# Altium project WIoT-Shield01.PrjPcb
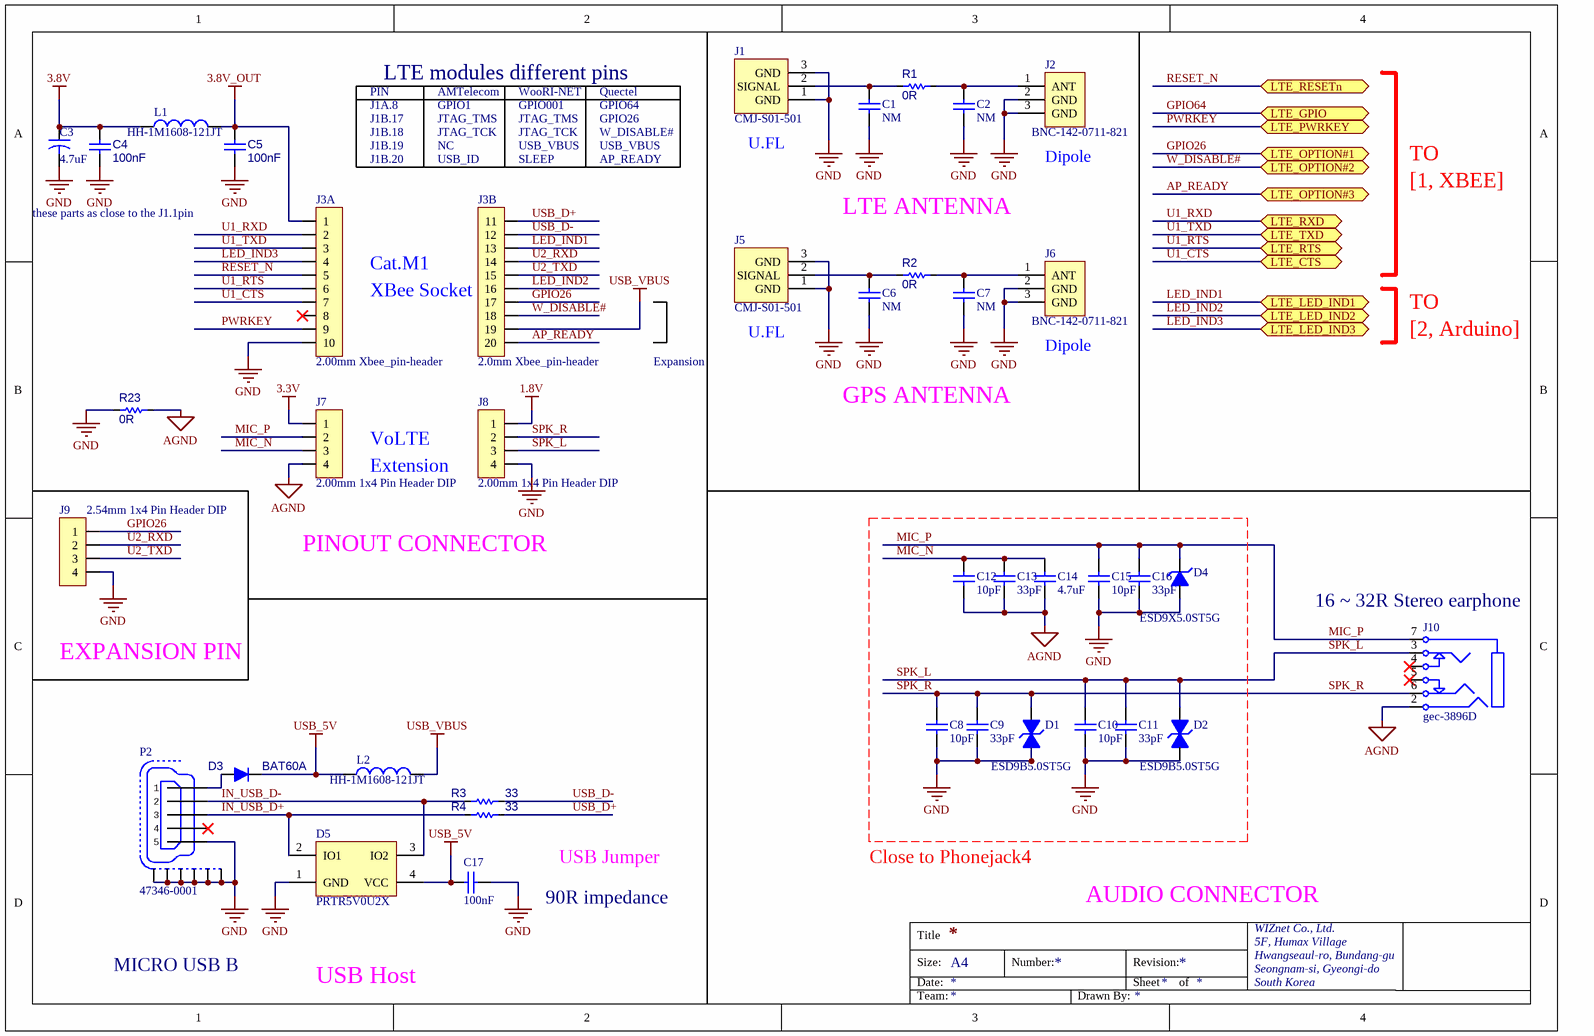
[diagram p0: 1.XBEE Interface.SchDoc]
3 sheets, 119 parts. Net scope: flat (ports and power ports of the same name join across sheets).
Board file: WIoT-Shield01.PcbDoc
Sheets:
  1.XBEE Interface.SchDoc
  2.Arduino Pinout.SchDoc
  3.POWER.SchDoc

## Sheet 1.XBEE Interface.SchDoc
size A4

### Parts
C1  NM  [CAP-0402]
C2  NM  [CAP-0402]
C3  4.7uF  [CAP-A Size]
C4  100nF  [CAP-0603]
C5  100nF  [CAP-0603]
C6  NM  [CAP-0402]
C7  NM  [CAP-0402]
C8  10pF  [CAP-0402]
C9  33pF  [CAP-0402]
C10  10pF  [CAP-0402]
C11  33pF  [CAP-0402]
C12  10pF  [CAP-0402]
C13  33pF  [CAP-0402]
C14  4.7uF  [CAP-0603]
C15  10pF  [CAP-0402]
C16  33pF  [CAP-0402]
C17  100nF  [CAP-0402]
D1  ESD9B5.0ST5G  [SOD-882(TVS)]
D2  ESD9B5.0ST5G  [SOD-882(TVS)]
D3  BAT60A  [SOD-323(1-C,2-A)]
D4  ESD9X5.0ST5G  [SOD-923(1-C,2-A)]
D5  PRTR5V0U2X  [SOT-143]
J1  CMJ-S01-501  [BNC-CMJ-S01-501]
J2  BNC-142-0711-821  [BNC-142-0711-821]
J3  2.00mm Xbee_pin-header  [XBEE(1)]  (parts A,B of 2)
J5  CMJ-S01-501  [BNC-CMJ-S01-501]
J6  BNC-142-0711-821  [BNC-142-0711-821]
J7  2.00mm 1x4 Pin Header DIP  [IDC-1X4(2MM)]
J8  2.00mm 1x4 Pin Header DIP  [IDC-1X4(2MM)]
J9  2.54mm 1x4 Pin Header DIP  [IDC-1X4]
J10  gec-3896D  [PJ-3.5-3106]
L1  HH-1M1608-121JT  [IND-0603]
L2  HH-1M1608-121JT  [IND-0603]
P2  47346-0001  [USB-MOLEX-47346]
R1  0R  [RES-0402]
R2  0R  [RES-0402]
R3  33  [RES-0603]
R4  33  [RES-0603]
R23  0R  [RES-0603]

### Ports
LTE_CTS, LTE_GPIO, LTE_LED_IND1, LTE_LED_IND2, LTE_LED_IND3, LTE_OPTION#1, LTE_OPTION#2, LTE_OPTION#3, LTE_PWRKEY, LTE_RESETn, LTE_RTS, LTE_RXD, LTE_TXD

### Nets
1.8V: J8.1
3.3V: J7.1
3.8V: C3.1 C4.1 L1.1
3.8V_OUT: C5.1 J3.1 L1.2
AGND: C12.1 C13.1 C14.1 J7.4 J10.2 R23.2
GND: C1.1 C2.1 C3.2 C4.2 C5.2 C6.1 C7.1 C8.1 C9.1 C10.1 C11.1 C15.1 C16.1 C17.2 D1.2 D2.2 D4.2 D5.1(GND) J1.1(GND) J1.3(GND) J2.2(GND) J2.3(GND) J3.10 J5.1(GND) J5.3(GND) J6.2(GND) J6.3(GND) J8.4 J9.4 P2.5 P2.6 P2.7 P2.8 P2.9 P2.10 P2.11 R23.1
USB_5V: C17.1 D3.1(K) D5.4(VCC) L2.1  [project net 5V]
USB_VBUS: J3.19 L2.2
AP_READY: J3.20 ; port LTE_OPTION#3
GPIO26: J3.17 J9.1 ; port LTE_OPTION#1
GPIO64: port LTE_GPIO
IN_USB_D+: D5.2(IO1) P2.3 R4.2
IN_USB_D-: D5.3(IO2) P2.2 R3.2
LED_IND1: J3.13 ; port LTE_LED_IND1
LED_IND2: J3.16 ; port LTE_LED_IND2
LED_IND3: J3.4 ; port LTE_LED_IND3
MIC_N: C12.2 C13.2 C14.2 J7.3
MIC_P: C15.2 C16.2 D4.1 J7.2 J10.7
PWRKEY: J3.9 ; port LTE_PWRKEY
RESET_N: J3.5 ; port LTE_RESETn
SPK_L: C10.2 C11.2 D2.1 J8.3 J10.3
SPK_R: C8.2 C9.2 D1.1 J8.2 J10.6
U1_CTS: J3.7 ; port LTE_CTS
U1_RTS: J3.6 ; port LTE_RTS
U1_RXD: J3.2 ; port LTE_RXD
U1_TXD: J3.3 ; port LTE_TXD
U2_RXD: J3.14 J9.2
U2_TXD: J3.15 J9.3
USB_D+: J3.11 R4.1
USB_D-: J3.12 R3.1
W_DISABLE#: J3.18 ; port LTE_OPTION#2
NetC1_2: C1.2 J1.2(SIGNAL) R1.1
NetC2_2: C2.2 J2.1(ANT) R1.2
NetC6_2: C6.2 J5.2(SIGNAL) R2.1
NetC7_2: C7.2 J6.1(ANT) R2.2
NetD3_2: D3.2(A) P2.1

Not connected (* = marked no-connect by the designer): J3 8*; J10 4* 5*; P2 4*

### Notes on the sheet
- J1A.8
- PIN
- LTE modules different pins
- AMTelecom
- GPIO1
- WooRI-NET
- GPIO001
- Quectel
- GPIO64
- J1B.17
- J1B.18
- J1B.19
- J1B.20
- USB_ID
- NC
- JTAG_TMS
- JTAG_TCK
- SLEEP
- USB_VBUS
- GPIO26
- W_DISABLE#
- AP_READY
- (near J1) U.FL
- (near J2) Dipole
- TO
- these parts as close to the J1.1pin
- LTE ANTENNA
- [1, XBEE]
- (near J3) XBee Socket
- Cat.M1
- Expansion
- (near J5) U.FL
- (near J6) Dipole
- [2, Arduino]
- VoLTE
- GPS ANTENNA
- Extension
- PINOUT CONNECTOR
- (near J10) 16 ~ 32R Stereo earphone
- EXPANSION PIN
- 90R impedance
- USB Jumper
- Close to Phonejack4
- AUDIO CONNECTOR
- MICRO USB B
- USB Host
- Title
- Size:
- Date:
- A4
- Number:
- Revision:
- Sheet
- of
- WIZnet Co., Ltd.
- 5F, Humax Village
- Hwangseaul-ro, Bundang-gu
- Seongnam-si, Gyeongi-do
- South Korea
- Team:
- Drawn By:

### Library data of the parts
C1 C2 C6-C13 C15 C16 = CAP-0402: Ceramic CAP 0402(1005)
C3 = CAP: Electrolytic Capacitors
C4 C5 C14 = CAP-0603: Ceramic CAP 0603(1608)
C17 = CAP-0805: Ceramic CAP 0402
D1 D2 = PESD5V0S1BL: Bi-directional TVS diode
D3 = DIODE-BAT60A: Silicon Schottky Diode
D4 = ESD9X5.0ST5G: Uni-directional TVS diode
D5 = PRTR5V0U2X: Ultra low capacitance double rail-to-rail ESD protection diode; Manufacturer: NXP; 2nd source part number: 152-4157; Artikkelnr Noca: 10069015; Artikkelnr Simpro: N.A.; Part Number: PRTR5V0U2X; Manufacturer Part Number: PRTR5V0U2X; Datasheet: http://www.farnell.com/datasheets/109718.pdf; LatestRevisionDate: 2012-06-11; Publisher: Nordic Semiconductor; Published: 2012-06-11; Value: PRTR5V0U2X; Note: *; Supplier: Digi-Key; Supplier part number: 568-4140-1-ND; 2nd source Supplier: Farnell; Footprint Doc: SOT-143B
J1 J5 = U.FL CONNECTOR
J2 J6 = SMA_Female
J3 = Xbee_pin-header: Xbee_pin-header, WizFi310, LoRa, LTE CAT M1
J10 = Phonejack 6: 3-Conductor Jack with 2 break contacts (normals) and 2 auxiliary make contacts; Published: 5-Jan-2004; LatestRevisionDate: 17-Dec-2003; LatestRevisionNote: PCB Footprint replaced.; DatasheetDocument: 07-Mar-2000; Publisher: Altium Limited; ComponentLink1Description: Manufacturer Link; ComponentLink1URL: http://domino.kycon.com/internet/Products.html
L1 L2 = IND-0603: Inductor 0603(1608)
P2 = 47346-0001: MICRO USB B Type
R1 R2 = RES-0402
R3 R4 R23 = RES-0603: RES0603

## Sheet 2.Arduino Pinout.SchDoc
size A4
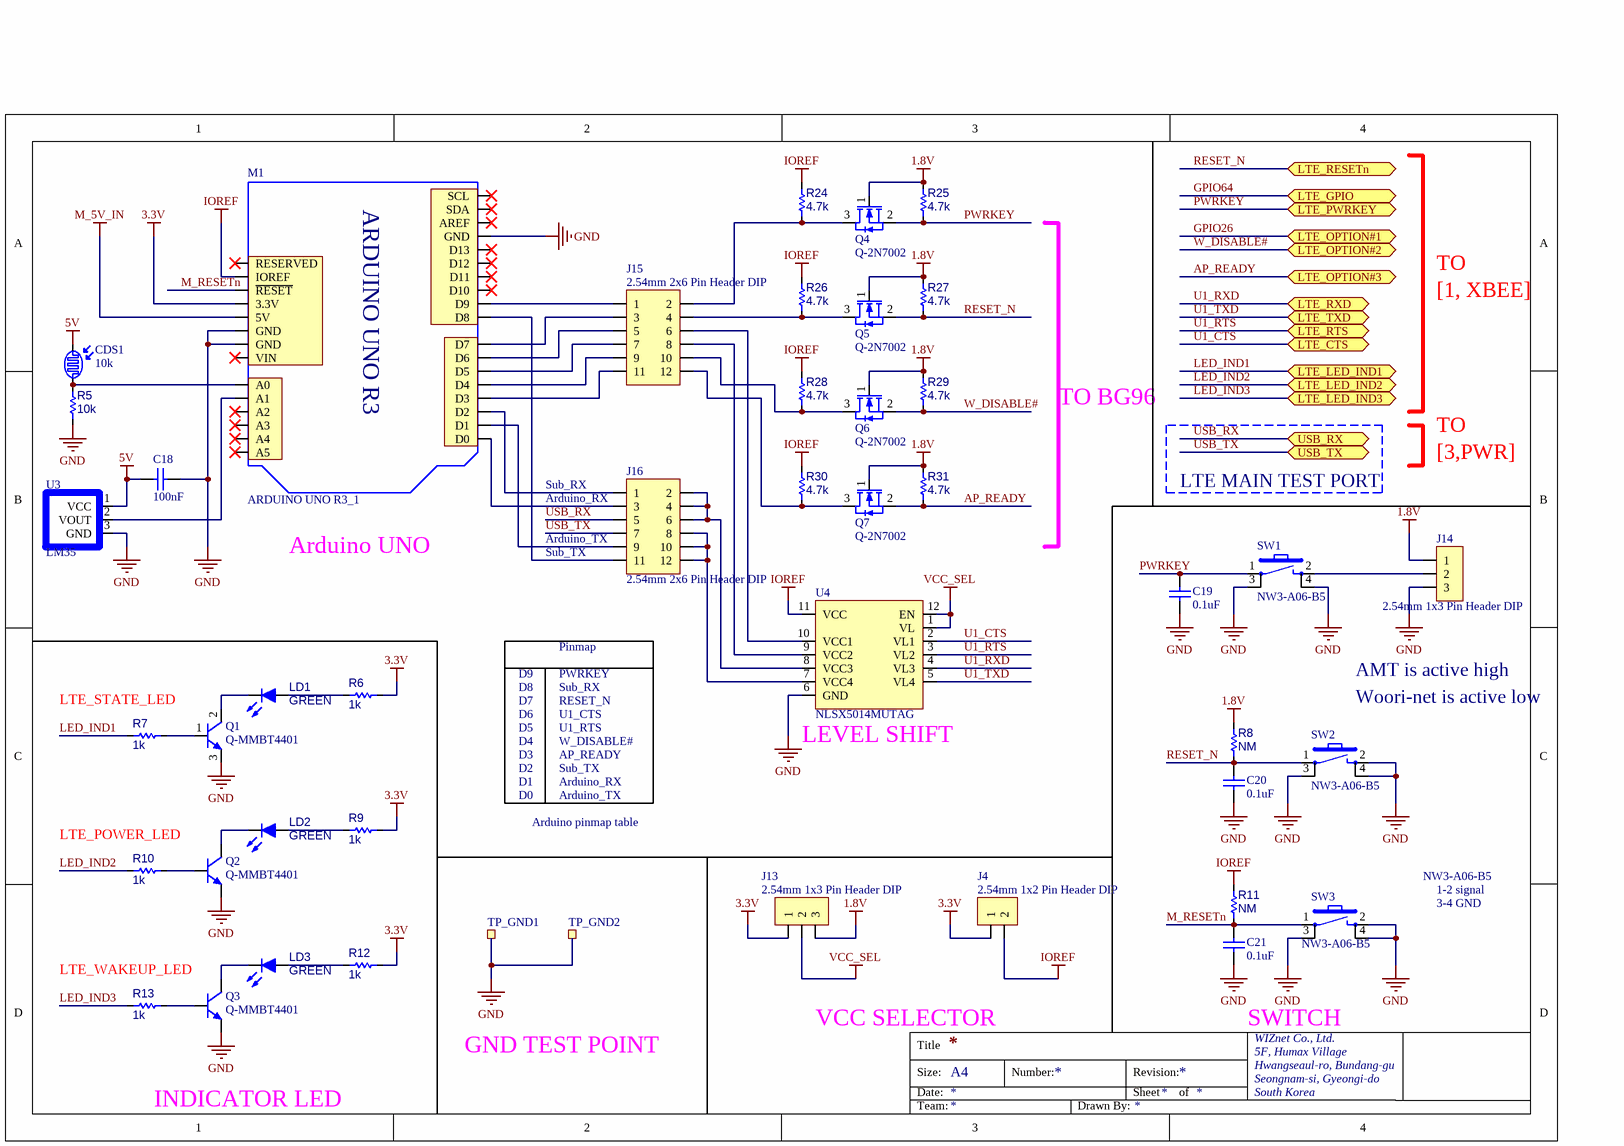
[diagram p1: 2.Arduino Pinout.SchDoc]

### Parts
C18  100nF  [CAP-0603]
C19  0.1uF  [CAP-0402]
C20  0.1uF  [CAP-0402]
C21  0.1uF  [CAP-0402]
CDS1  10k  [GL55]
J4  2.54mm 1x2 Pin Header DIP  [IDC-1X2]
J13  2.54mm 1x3 Pin Header DIP  [IDC-1X3]
J14  2.54mm 1x3 Pin Header DIP  [IDC-1X3]
J15  2.54mm 2x6 Pin Header DIP  [IDC-2X6]
J16  2.54mm 2x6 Pin Header DIP  [IDC-2X6]
LD1  GREEN  [LED-0603-GREEN]
LD2  GREEN  [LED-0603-GREEN]
LD3  GREEN  [LED-0603-GREEN]
M1  ARDUINO UNO R3_1  [ARDUINOR3_ICSP(4)]
Q1  Q-MMBT4401  [SOT-23-3LL]
Q2  Q-MMBT4401  [SOT-23-3LL]
Q3  Q-MMBT4401  [SOT-23-3LL]
Q4  Q-2N7002  [SOT-23-3L]
Q5  Q-2N7002  [SOT-23-3L]
Q6  Q-2N7002  [SOT-23-3L]
Q7  Q-2N7002  [SOT-23-3L]
R5  10k  [RES-0603]
R6  1k  [RES-0402]
R7  1k  [RES-0402]
R8  NM  [RES-0402]
R9  1k  [RES-0402]
R10  1k  [RES-0402]
R11  NM  [RES-0402]
R12  1k  [RES-0402]
R13  1k  [RES-0402]
R24  4.7k  [RES-0402]
R25  4.7k  [RES-0402]
R26  4.7k  [RES-0402]
R27  4.7k  [RES-0402]
R28  4.7k  [RES-0402]
R29  4.7k  [RES-0402]
R30  4.7k  [RES-0402]
R31  4.7k  [RES-0402]
SW1  NW3-A06-B5  [NW3-A06]
SW2  NW3-A06-B5  [NW3-A06]
SW3  NW3-A06-B5  [NW3-A06]
TP_GND1  TESTPOINT  [TP]  (value not drawn)
TP_GND2  TESTPOINT  [TP]  (value not drawn)
U3  LM35  [TO-92]
U4  NLSX5014MUTAG  [UQFN12(0.4/1.7X2)]

### Ports
LTE_CTS, LTE_GPIO, LTE_LED_IND1, LTE_LED_IND2, LTE_LED_IND3, LTE_OPTION#1, LTE_OPTION#2, LTE_OPTION#3, LTE_PWRKEY, LTE_RESETn, LTE_RTS, LTE_RXD, LTE_TXD, USB_RX, USB_TX

### Nets
1.8V: J13.3 J14.1 Q4.1(G) Q5.1(G) Q6.1(G) Q7.1(G) R8.2 R25.2 R27.2 R29.2 R31.2
3.3V: J4.1 J13.1 M1.3.3V R6.2 R9.2 R12.2
5V: C18.2 CDS1.1 U3.1(VCC)
GND: C18.1 C19.1 C20.1 C21.1 J14.3 M1.GND1(GND) M1.GND2(GND) M1.GND4(GND) Q1.3(E) Q2.3(E) Q3.3(E) R5.1 SW1.3(GND) SW1.4(GND) SW2.2 SW2.3(GND) SW2.4(GND) SW3.2 SW3.3(GND) SW3.4(GND) TP_GND1.1(TETSPOINT) TP_GND2.1(TETSPOINT) U3.3(GND) U4.6(GND)
IOREF: J4.2 M1.IOREF R11.2 R24.2 R26.2 R28.2 R30.2 U4.11(VCC)
M_5V_IN: M1.5V
VCC_SEL: J13.2 U4.1(VL) U4.12(EN)
AP_READY: Q7.2(S) R31.1 ; port LTE_OPTION#3
GPIO64: port LTE_GPIO
LED_IND1: R7.1 ; port LTE_LED_IND1
LED_IND2: R10.1 ; port LTE_LED_IND2
LED_IND3: R13.1 ; port LTE_LED_IND3
M_RESETn: C21.2 M1.\RESET(~{RESET}) R11.1 SW3.1
PWRKEY: C19.2 Q4.2(S) R25.1 SW1.1 ; port LTE_PWRKEY
RESET_N: C20.2 Q5.2(S) R8.1 R27.1 SW2.1 ; port LTE_RESETn
U1_CTS: U4.2(VL1) ; port LTE_CTS
U1_RTS: U4.3(VL2) ; port LTE_RTS
U1_RXD: U4.4(VL3) ; port LTE_RXD
U1_TXD: U4.5(VL4) ; port LTE_TXD
USB_RX: J16.5 ; port USB_RX
USB_TX: J16.7 ; port USB_TX
W_DISABLE#: Q6.2(S) R29.1 ; port LTE_OPTION#2
NetCDS1_2: CDS1.2 M1.A0 R5.2
NetJ14_2: J14.2 SW1.2
NetJ15_1: J15.1 M1.D9
NetJ15_2: J15.2 Q4.3(D) R24.1
NetJ15_3: J15.3 M1.D7
NetJ15_4: J15.4 Q5.3(D) R26.1
NetJ15_5: J15.5 M1.D6
NetJ15_6: J15.6 U4.10(VCC1)
NetJ15_7: J15.7 M1.D5
NetJ15_8: J15.8 U4.9(VCC2)
NetJ15_9: J15.9 M1.D4
NetJ15_10: J15.10 Q6.3(D) R28.1
NetJ15_11: J15.11 M1.D3
NetJ15_12: J15.12 Q7.3(D) R30.1
NetJ16_1: J16.1 M1.D2
NetJ16_2: J16.2 J16.4 J16.6 U4.8(VCC3)
NetJ16_3: J16.3 M1.D0
NetJ16_8: J16.8 J16.10 J16.12 U4.7(VCC4)
NetJ16_9: J16.9 M1.D1
NetJ16_11: J16.11 M1.D8
NetLD1_1: LD1.1(A) R6.1
NetLD1_2: LD1.2(K) Q1.2(C)
NetLD2_1: LD2.1(A) R9.1
NetLD2_2: LD2.2(K) Q2.2(C)
NetLD3_1: LD3.1(A) R12.1
NetLD3_2: LD3.2(K) Q3.2(C)
NetM1_A1: M1.A1 U3.2(VOUT)
NetQ1_1: Q1.1(B) R7.2
NetQ2_1: Q2.1(B) R10.2
NetQ3_1: Q3.1(B) R13.2

Not connected (* = marked no-connect by the designer): M1 A2* A3* A4* A5* AREF* D10* D11* D12* D13* RESERVED* SCL* SDA* VIN*

### Notes on the sheet
- TO
- [1, XBEE]
- TO BG96
- (near J16) Sub_RX
- LTE MAIN TEST PORT
- [3,PWR]
- Arduino UNO
- (near J16) Arduino_RX
- (near J16) Arduino_TX
- (near J16) Sub_TX
- D8
- D9
- Sub_RX
- PWRKEY
- Pinmap
- AMT is active high
- (near R7) LTE_STATE_LED
- D7
- D6
- D5
- D4
- D3
- RESET_N
- U1_CTS
- U1_RTS
- W_DISABLE#
- AP_READY
- (near U4) LEVEL SHIFT
- Woori-net is active low
- D2
- D1
- D0
- Arduino pinmap table
- Sub_TX
- Arduino_RX
- Arduino_TX
- (near R10) LTE_POWER_LED
- NW3-A06-B5
- 1-2 signal
- 3-4 GND
- (near R13) LTE_WAKEUP_LED
- VCC SELECTOR
- SWITCH
- GND TEST POINT
- INDICATOR LED
- Title
- Size:
- Date:
- A4
- Number:
- Revision:
- Sheet
- of
- WIZnet Co., Ltd.
- 5F, Humax Village
- Hwangseaul-ro, Bundang-gu
- Seongnam-si, Gyeongi-do
- South Korea
- Team:
- Drawn By:
- (in symbol ARDUINO UNO R3_1) ARDUINO UNO R3

### Library data of the parts
C18 = CAP-0603: Ceramic CAP 0603(1608)
C19-C21 = CAP-0402: Ceramic CAP 0402(1005)
CDS1 = CDS
LD1-LD3 = LED-0603
M1 = ARDUINO UNO R3_1: Arduino UNO R3
Q1-Q3 = Q-MMBT4401: NPN General-Purpose Amplifier
Q4-Q7 = Q-2N7002: N-Channel 60-V (D-S) MOSFET
R5 = RES-0603: RES0603
R6-R13 R24-R31 = RES-0402
SW1-SW3 = SWITCH-ANGLE_TACT: Angle TACT SW, SMD
TP_GND1 TP_GND2 = TESTPOINT: TEST POINT
U4 = NLSX5014MUTAG: Level-Shifter

## Sheet 3.POWER.SchDoc
size A4
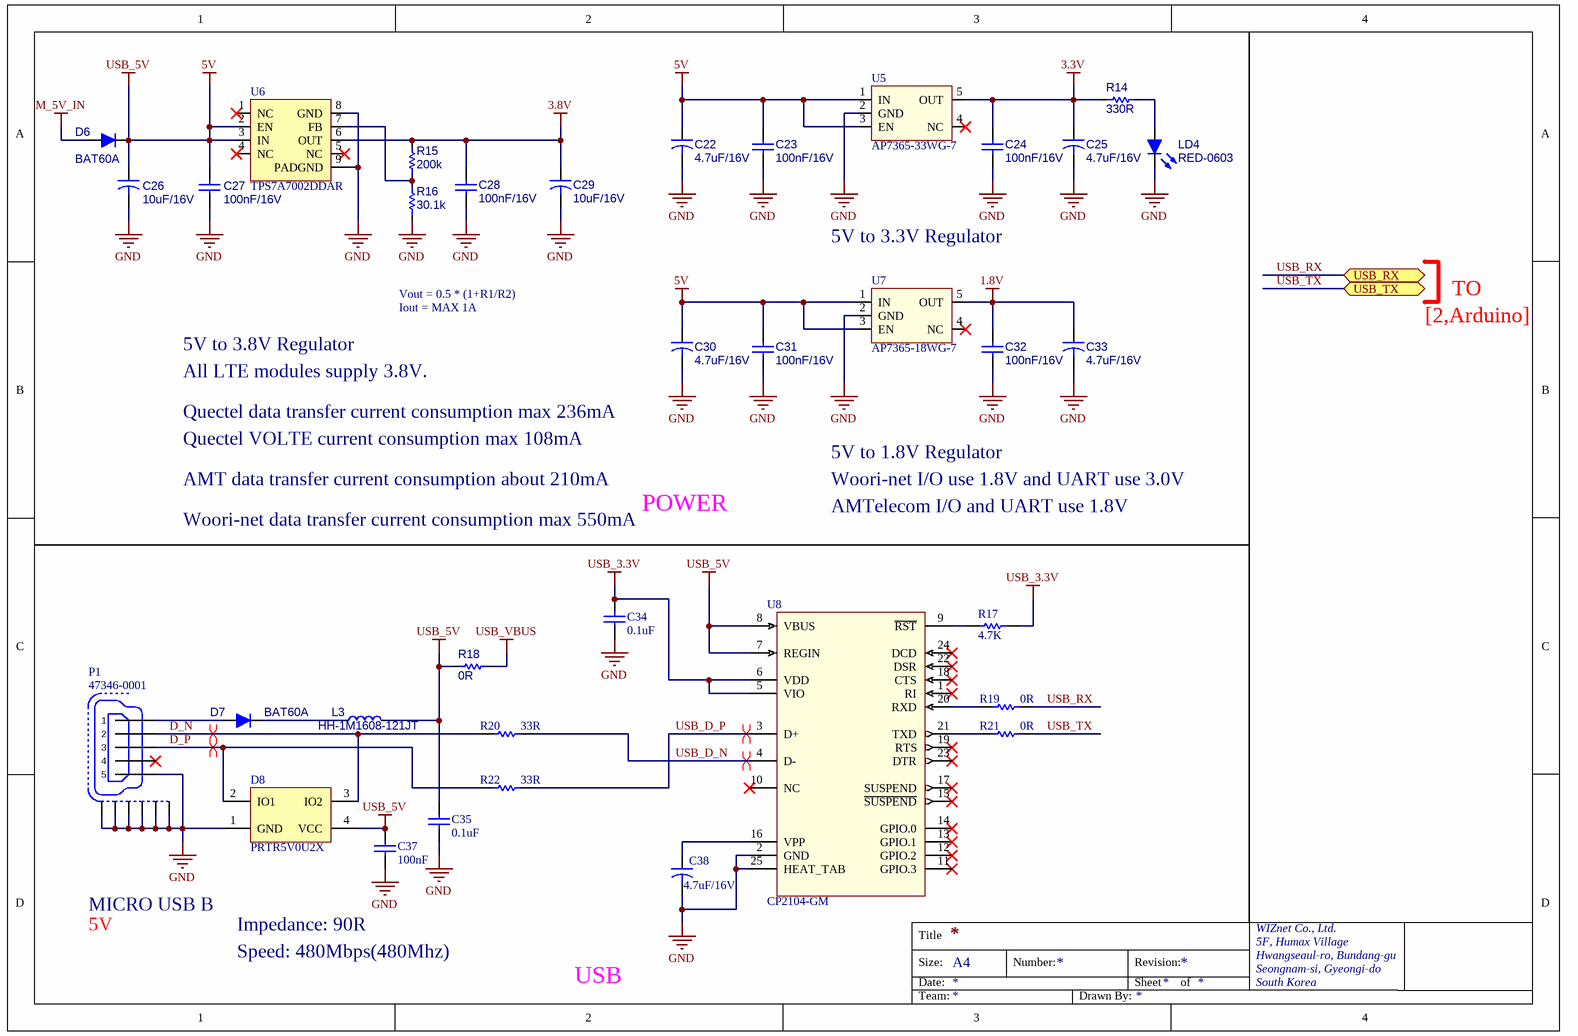
[diagram p2: 3.POWER.SchDoc]

### Parts
C22  4.7uF/16V  [CAP-A Size]
C23  100nF/16V  [CAP-0603]
C24  100nF/16V  [CAP-0603]
C25  4.7uF/16V  [CAP-A Size]
C26  10uF/16V  [CAP-A Size]
C27  100nF/16V  [CAP-0603]
C28  100nF/16V  [CAP-0603]
C29  10uF/16V  [CAP-A Size]
C30  4.7uF/16V  [CAP-A Size]
C31  100nF/16V  [CAP-0603]
C32  100nF/16V  [CAP-0603]
C33  4.7uF/16V  [CAP-A Size]
C34  0.1uF  [CAP-0603]
C35  0.1uF  [CAP-0603]
C37  100nF  [CAP-0603]
C38  4.7uF/16V  [CAP-A Size]
D6  BAT60A  [SOD-323(1-C,2-A)]
D7  BAT60A  [SOD-323(1-C,2-A)]
D8  PRTR5V0U2X  [SOT-143]
L3  HH-1M1608-121JT  [IND-0603]
LD4  RED-0603  [LED-0603-RED]
P1  47346-0001  [USB-MOLEX-47346]
R14  330R  [RES-0402]
R15  200k  [RES-0603]
R16  30.1k  [RES-0603]
R17  4.7K  [RES-0603]
R18  0R  [RES-0402]
R19  0R  [RES-0603]
R20  33R  [RES-0603]
R21  0R  [RES-0603]
R22  33R  [RES-0603]
U5  AP7365-33WG-7  [SOT-25]
U6  TPS7A7002DDAR  [SO-08-EP]
U7  AP7365-18WG-7  [SOT-25]
U8  CP2104-GM  [QFN24(0.5/4X4)]

### Ports
USB_RX, USB_TX

### Nets
1.8V: C32.2 C33.1 U7.5(OUT)
3.3V: C24.2 C25.1 R14.1 U5.5(OUT)
3.8V: C28.2 C29.1 R15.2 U6.6(OUT)
5V: C22.1 C23.2 C26.1 C27.2 C30.1 C31.2 C35.2 C37.2 D6.1(K) D8.4(VCC) L3.2 R18.1 U5.1(IN) U5.3(EN) U6.2(EN) U6.3(IN) U7.1(IN) U7.3(EN) U8.7(REGIN) U8.8(VBUS)  [also labelled USB_5V]
GND: C22.2 C23.1 C24.1 C25.2 C26.2 C27.1 C28.1 C29.2 C30.2 C31.1 C32.1 C33.2 C34.1 C35.1 C37.1 C38.2 D8.1(GND) LD4.2(K) P1.5 P1.6 P1.7 P1.8 P1.9 P1.10 P1.11 R16.1 U5.2(GND) U6.8(GND) U6.9(PADGND) U7.2(GND) U8.2(GND) U8.25(HEAT_TAB)
M_5V_IN: D6.2(A)
USB_3.3V: C34.2 R17.2 U8.5(VIO) U8.6(VDD)
USB_VBUS: R18.2
D_N: D8.3(IO2) P1.2 R20.1
D_P: D8.2(IO1) P1.3 R22.1
USB_D_N: R20.2 U8.4(D-)
USB_D_P: R22.2 U8.3(D+)
USB_RX: R19.2 ; port USB_RX
USB_TX: R21.2 ; port USB_TX
NetC38_1: C38.1 U8.16(VPP)
NetD7_1: D7.1(K) L3.1
NetD7_2: D7.2(A) P1.1
NetLD4_1: LD4.1(A) R14.2
NetR15_1: R15.1 R16.2 U6.7(FB)
NetR17_1: R17.1 U8.9(~{RST})
NetR19_1: R19.1 U8.20(RXD)
NetR21_1: R21.1 U8.21(TXD)

Not connected (* = marked no-connect by the designer): P1 4*; U5 4(NC)*; U6 1(NC)* 4(NC)* 5(NC)*; U7 4(NC)*; U8 1(RI)* 10(NC)* 11(GPIO.3)* 12(GPIO.2)* 13(GPIO.1)* 14(GPIO.0)* 15(~{SUSPEND})* 17(SUSPEND)* 18(CTS)* 19(RTS)* 22(DSR)* 23(DTR)* 24(DCD)*

### Layout directives
differential pair: D_N, D_P, USB_D_N, USB_D_P

### Notes on the sheet
- 5V to 3.3V Regulator
- Vout = 0.5 * (1+R1/R2)
- Iout = MAX 1A
- TO
- 5V to 3.8V Regulator
- All LTE modules supply 3.8V.
- [2,Arduino]
- (near C30) Quectel data transfer current consumption max 236mA
- Quectel VOLTE current consumption max 108mA
- AMT data transfer current consumption about 210mA
- POWER
- 5V to 1.8V Regulator
- Woori-net I/O use 1.8V and UART use 3.0V
- AMTelecom I/O and UART use 1.8V
- Woori-net data transfer current consumption max 550mA
- MICRO USB B
- 5V
- Impedance: 90R
- Speed: 480Mbps(480Mhz)
- USB
- Title
- Size:
- Date:
- A4
- Number:
- Revision:
- Sheet
- of
- WIZnet Co., Ltd.
- 5F, Humax Village
- Hwangseaul-ro, Bundang-gu
- Seongnam-si, Gyeongi-do
- South Korea
- Team:
- Drawn By:

### Library data of the parts
C22 C25 C26 C29 C30 C33 = CAP-A Size: Tantal CAP A Size EIA/IECQ 3216
C23 C24 C27 C28 C31 C32 C34 C35 C37 = CAP-0603: Ceramic CAP 0603(1608)
C38 = CAP-A Size: Tantla CAP A Size EIA/IECQ 3216
D6 D7 = DIODE-BAT60A: Silicon Schottky Diode
D8 = PRTR5V0U2X: as D5 on sheet 1.XBEE Interface; Part Number: PRTR5V0U2X; Manufacturer Part Number: PRTR5V0U2X; Datasheet: http://www.farnell.com/datasheets/109718.pdf; LatestRevisionDate: 2012-06-11; Publisher: Nordic Semiconductor; Published: 2012-06-11; Value: PRTR5V0U2X; Note: *; Supplier: Digi-Key; Supplier part number: 568-4140-1-ND; 2nd source Supplier: Farnell; Footprint Doc: SOT-143B
L3 = IND-0603: Inductor 0603(1608)
LD4 = LED-0603
P1 = 47346-0001: MICRO USB B Type
R14 R18 = RES-0402
R15 R16 = RES-0603: RES0603
R17 R19-R22 = RES-0603
U5 U7 = AP7365-33WG-7: 3.3V 600mA Regulator/SOT25(Fixed Output)
U8 = CP2104-GM: USB to UART Bridge, SiliconLabs; RefDes: RefDes; Type: Type; Value: Value

## Nets that join several sheets
1.8V: 1.XBEE Interface (J8.1), 2.Arduino Pinout (11 pins), 3.POWER (C32.2 C33.1 U7.5)
3.3V: 1.XBEE Interface (J7.1), 2.Arduino Pinout (6 pins), 3.POWER (C24.2 C25.1 R14.1 U5.5)
3.8V: 1.XBEE Interface (C3.1 C4.1 L1.1), 3.POWER (C28.2 C29.1 R15.2 U6.6)
5V: 1.XBEE Interface (C17.1 D3.1 D5.4 L2.1), 2.Arduino Pinout (C18.2 CDS1.1 U3.1), 3.POWER (20 pins)
GND: 1.XBEE Interface (37 pins), 2.Arduino Pinout (24 pins), 3.POWER (32 pins)
M_5V_IN: 2.Arduino Pinout (M1.5V), 3.POWER (D6.2)
USB_VBUS: 1.XBEE Interface (J3.19 L2.2), 3.POWER (R18.2)
AP_READY: 1.XBEE Interface (J3.20), 2.Arduino Pinout (Q7.2 R31.1)
LED_IND1: 1.XBEE Interface (J3.13), 2.Arduino Pinout (R7.1)
LED_IND2: 1.XBEE Interface (J3.16), 2.Arduino Pinout (R10.1)
LED_IND3: 1.XBEE Interface (J3.4), 2.Arduino Pinout (R13.1)
PWRKEY: 1.XBEE Interface (J3.9), 2.Arduino Pinout (C19.2 Q4.2 R25.1 SW1.1)
RESET_N: 1.XBEE Interface (J3.5), 2.Arduino Pinout (5 pins)
U1_CTS: 1.XBEE Interface (J3.7), 2.Arduino Pinout (U4.2)
U1_RTS: 1.XBEE Interface (J3.6), 2.Arduino Pinout (U4.3)
U1_RXD: 1.XBEE Interface (J3.2), 2.Arduino Pinout (U4.4)
U1_TXD: 1.XBEE Interface (J3.3), 2.Arduino Pinout (U4.5)
USB_RX: 2.Arduino Pinout (J16.5), 3.POWER (R19.2)
USB_TX: 2.Arduino Pinout (J16.7), 3.POWER (R21.2)
W_DISABLE#: 1.XBEE Interface (J3.18), 2.Arduino Pinout (Q6.2 R29.1)